# Altium schematic sheet Power_management.SchDoc
size A4; SheetNumber: 4; SheetTotal: 8
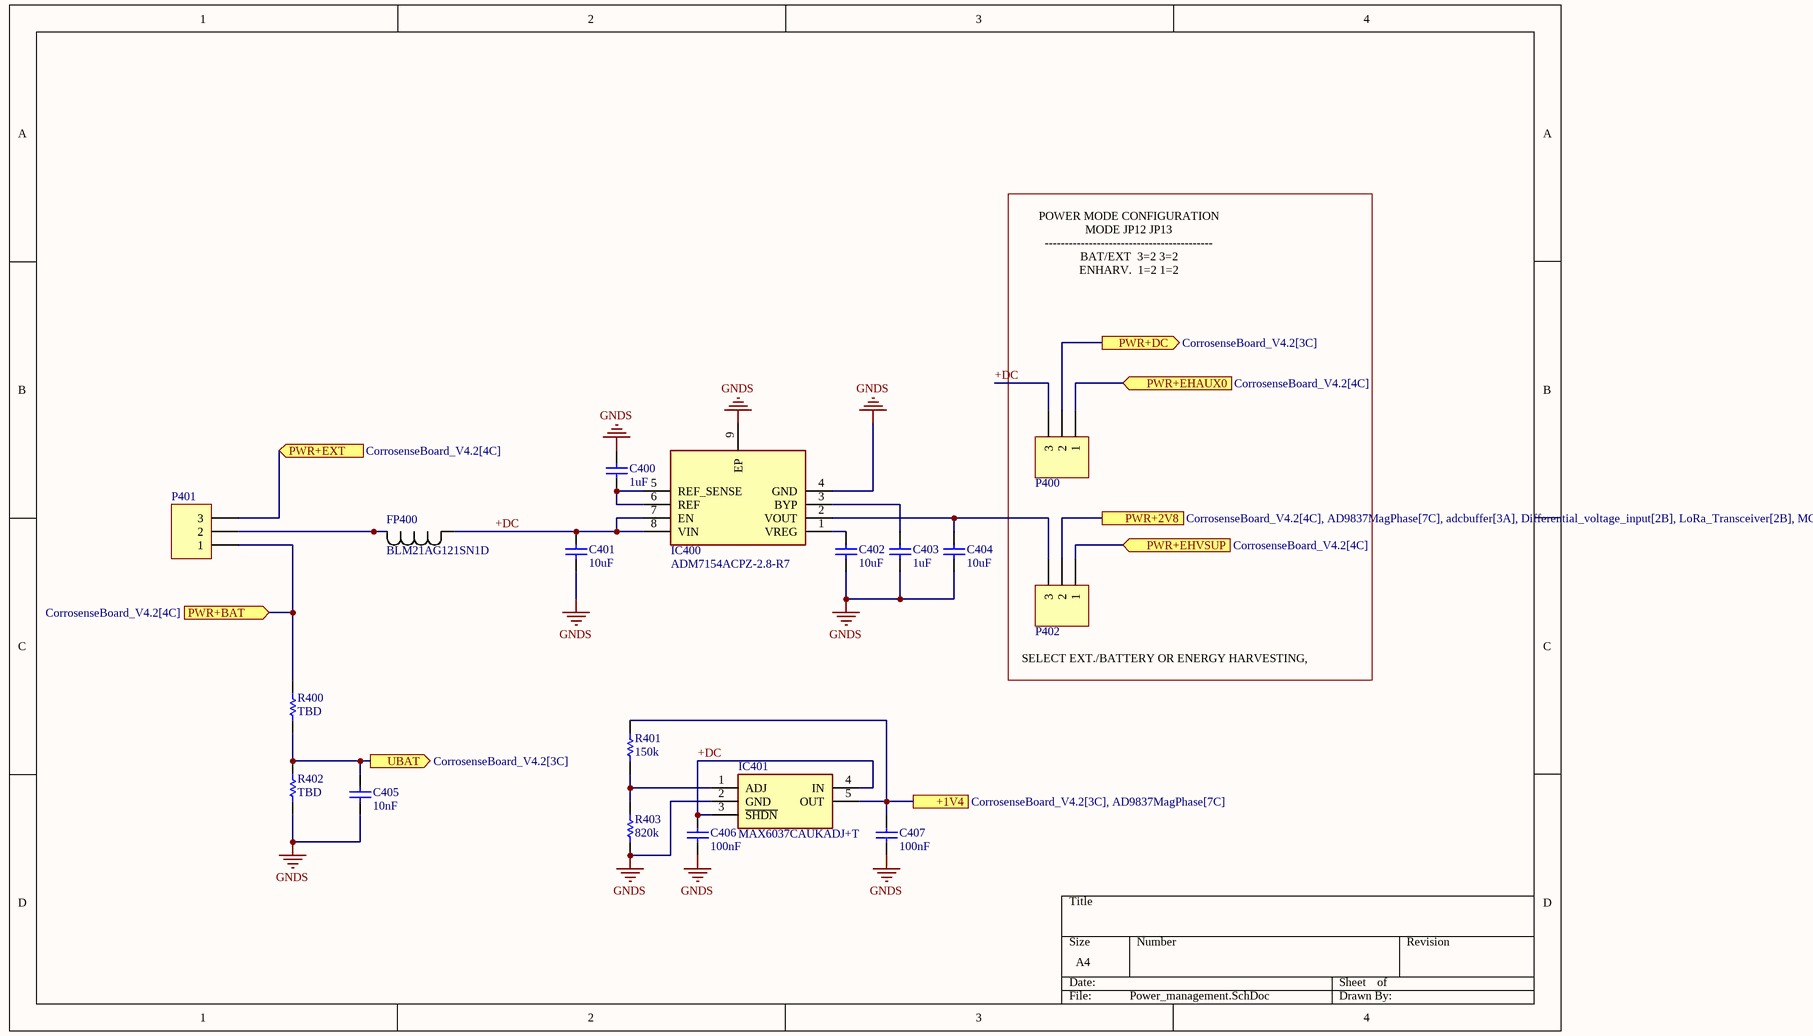
[diagram p0: Power_management.SchDoc]

## Parts
C400  1uF  [1608[0603]]
C401  10uF  [1608[0603]]
C402  10uF  [1608[0603]]
C403  1uF  [1608[0603]]
C404  10uF  [1608[0603]]
C405  10nF  [1608[0603]]
C406  100nF  [1608[0603]]
C407  100nF  [1608[0603]]
FP400  BLM21AG121SN1D  [BEADC2012X105N]
IC400  ADM7154ACPZ-2.8-R7  [SON50P300X300X80-9N-D]
IC401  MAX6037CAUKADJ+T  [SOT95P280X145-5N]
P400  Header, 3-Pin  [HDR1X3]  (value not drawn)
P401  Header, 3-Pin  [HDR1X3]  (value not drawn)
P402  Header, 3-Pin  [HDR1X3]  (value not drawn)
R400  value TBD  [1608[0603]]
R401  150k  [1608[0603]]
R402  value TBD  [1608[0603]]
R403  820k  [1608[0603]]

## Blocks framed on the sheet
SELECT EXT./BATTERY OR ENERGY HARVESTING,: P400 P402

## Ports
+1V4 (see CorrosenseBoard_V4.2[3C], AD9837MagPhase[7C]), PWR+2V8 (see CorrosenseBoard_V4.2[4C], AD9837MagPhase[7C], adcbuffer[3A], Differential_voltage_input[2B], LoRa_Transceiver[2B], MCU[3D]), PWR+BAT (in, see CorrosenseBoard_V4.2[4C]), PWR+DC (out, see CorrosenseBoard_V4.2[3C]), PWR+EHAUX0 (in, see CorrosenseBoard_V4.2[4C]), PWR+EHVSUP (in, see CorrosenseBoard_V4.2[4C]), PWR+EXT (in, see CorrosenseBoard_V4.2[4C]), UBAT (out, see CorrosenseBoard_V4.2[3C])

## Nets
GNDS: C400.1 C401.2 C402.1 C403.2 C404.2 C405.1 C406.2 C407.2 IC400.4(GND) IC400.9(EP) IC401.2(GND) R402.1 R403.1
+1V4: C407.1 IC401.5(OUT) R401.2 ; port +1V4
+DC: C401.1 C406.1 FP400.2 IC400.7(EN) IC400.8(VIN) IC401.3(~{SHDN}) IC401.4(IN) P400.3
PWR+2V8: P402.2 ; port PWR+2V8
PWR+BAT: P401.1 R400.2 ; port PWR+BAT
PWR+DC: P400.2 ; port PWR+DC
PWR+EHAUX0: P400.1 ; port PWR+EHAUX0
PWR+EHVSUP: P402.1 ; port PWR+EHVSUP
PWR+EXT: P401.3 ; port PWR+EXT
UBAT: C405.2 R400.1 R402.2 ; port UBAT
NetC400_2: C400.2 IC400.5(REF_SENSE) IC400.6(REF)
NetC402_2: C402.2 IC400.1(VREG)
NetC403_1: C403.1 IC400.3(BYP)
NetC404_1: C404.1 IC400.2(VOUT) P402.3
NetFP400_1: FP400.1 P401.2
NetIC401_1: IC401.1(ADJ) R401.1 R403.2

## Notes on the sheet
- Type @ to refer to a designator or a net
- POWER MODE CONFIGURATION
  MODE	JP12	JP13
  ------------------------------------------
  BAT/EXT  3=2	3=2
  ENHARV.  1=2	1=2

## Library data of the parts
C400 C403 = Cap: CAP CER 25V X7R 0603; Manufacturer: Murata Electronics; MPN: GCM188R71E105KA64D; Tolerance: ±10%; Value: 1uF; Operating Temperature: -55°C ~ 125°C; Package / Case: 0603 (1608 Metric); Temperature Coefficient: X7R; Voltage - Rated: 25V
C401 C402 C404 = Cap: CAP CER 25V X7R 0603; Manufacturer: Murata Electronics; MPN: GRM188R61E106KA73D; Tolerance: ±10%; Value: 10uF; Operating Temperature: -55°C ~ 125°C; Package / Case: 0603 (1608 Metric); Temperature Coefficient: X7R; Voltage - Rated: 25V
C405 = Cap: CAP CER 25V X7R 0603; Manufacturer: Murata Electronics; MPN: GCJ188R71E103KA01J; Tolerance: ±10%; Value: 10nF; Operating Temperature: -55°C ~ 125°C; Package / Case: 0603 (1608 Metric); Temperature Coefficient: X7R; Voltage - Rated: 25V
C406 C407 = Cap: CAP CER 25V X7R 0603; Manufacturer: Murata Electronics; MPN: GCJ188R71E104KA12D; Tolerance: ±10%; Value: 100nF; Operating Temperature: -55°C ~ 125°C; Package / Case: 0603 (1608 Metric); Temperature Coefficient: X7R; Voltage - Rated: 25V
FP400 = BLM21AG121SN1D: No Description Available; Mfr_Name: Murata; Manufacturer: Murata Electronics; MPN: BLM21AG121SN1D
IC400 = ADM7154ACPZ-2.8-R7: Integrated Circuit; Manufacturer_Name: Analog Devices; Datasheet Link: https://componentsearchengine.com/Datasheets/1/ADM7154ACPZ-2.8-R7.pdf; Height: 0.8mm; Manufacturer_Part_Number: ADM7154ACPZ-2.8-R7; Mouser Part Number: 584-ADM7154ACPZ2.8R7; Mouser Price/Stock: https://www.mouser.co.uk/ProductDetail/Analog-Devices/ADM7154ACPZ-2.8-R7?qs=iCT64eccu7gPTq8Fv%2FiWJw%3D%3D; Arrow Part Number: ADM7154ACPZ-2.8-R7; Arrow Price/Stock: https://www.arrow.com/en/products/adm7154acpz-2.8-r7/analog-devices?region=nac; Manufacturer: Analog Devices; MPN: ADM7154ACPZ-2.8-R7
IC401 = MAX6037CAUKADJ+T: Integrated Circuit; Manufacturer_Name: Analog Devices; Datasheet Link: https://componentsearchengine.com/Datasheets/2/MAX6037CAUKADJ+T.pdf; Height: 1.45mm; Manufacturer_Part_Number: MAX6037CAUKADJ+T; Mouser Part Number: 700-MAX6037CAUKADJT; Mouser Price/Stock: https://www.mouser.co.uk/ProductDetail/Maxim-Integrated/MAX6037CAUKADJ%2bT?qs=GxOUx7aO6nwbjANjomWkGA%3D%3D; Arrow Part Number: MAX6037CAUKADJ+T; Arrow Price/Stock: https://www.arrow.com/en/products/max6037caukadjt/maxim-integrated?region=nac; Manufacturer: Analog Devices; MPN: MAX6037CAUKADJ+T
P400-P402 = Header 3: Manufacturer: Wurth Elektronik; MPN: 61300311121; Publisher: Altium Limited
R400 R402 = Res1: RES SMD 2% 1.5W 0603; MP: -65°C ~ 155°C; Publisher: Altium Limited; Code_JEITA: Thick Film; Package: 0603 (1608 Metric); Temperature Coefficient: 2%; Composition: Thick Film; Operating Temperature: -65°C ~ 155°C; Power (Watts): 1.5W; Tolerance: 2%; Manufacturer: *; MPN: *
R401 = Res1: RES SMD 2% 1.5W 0603; Manufacturer: YAGEO; MPN: AC0603FR-07150KL; MP: -65°C ~ 155°C; Publisher: Altium Limited; Value: 150k; Code_JEITA: Thick Film; Package: 0603 (1608 Metric); Temperature Coefficient: 2%; Composition: Thick Film; Operating Temperature: -65°C ~ 155°C; Power (Watts): 1.5W; Tolerance: 2%
R403 = Res1: RES SMD 2% 1.5W 0603; Manufacturer: YAGEO; MPN: AC0603FR-07820KL; MP: -65°C ~ 155°C; Publisher: Altium Limited; Value: 820k; Code_JEITA: Thick Film; Package: 0603 (1608 Metric); Temperature Coefficient: 2%; Composition: Thick Film; Operating Temperature: -65°C ~ 155°C; Power (Watts): 1.5W; Tolerance: 2%